# EAGLE design rapidshark-fuse-mk-1.0 (EAGLE 6.5.0)
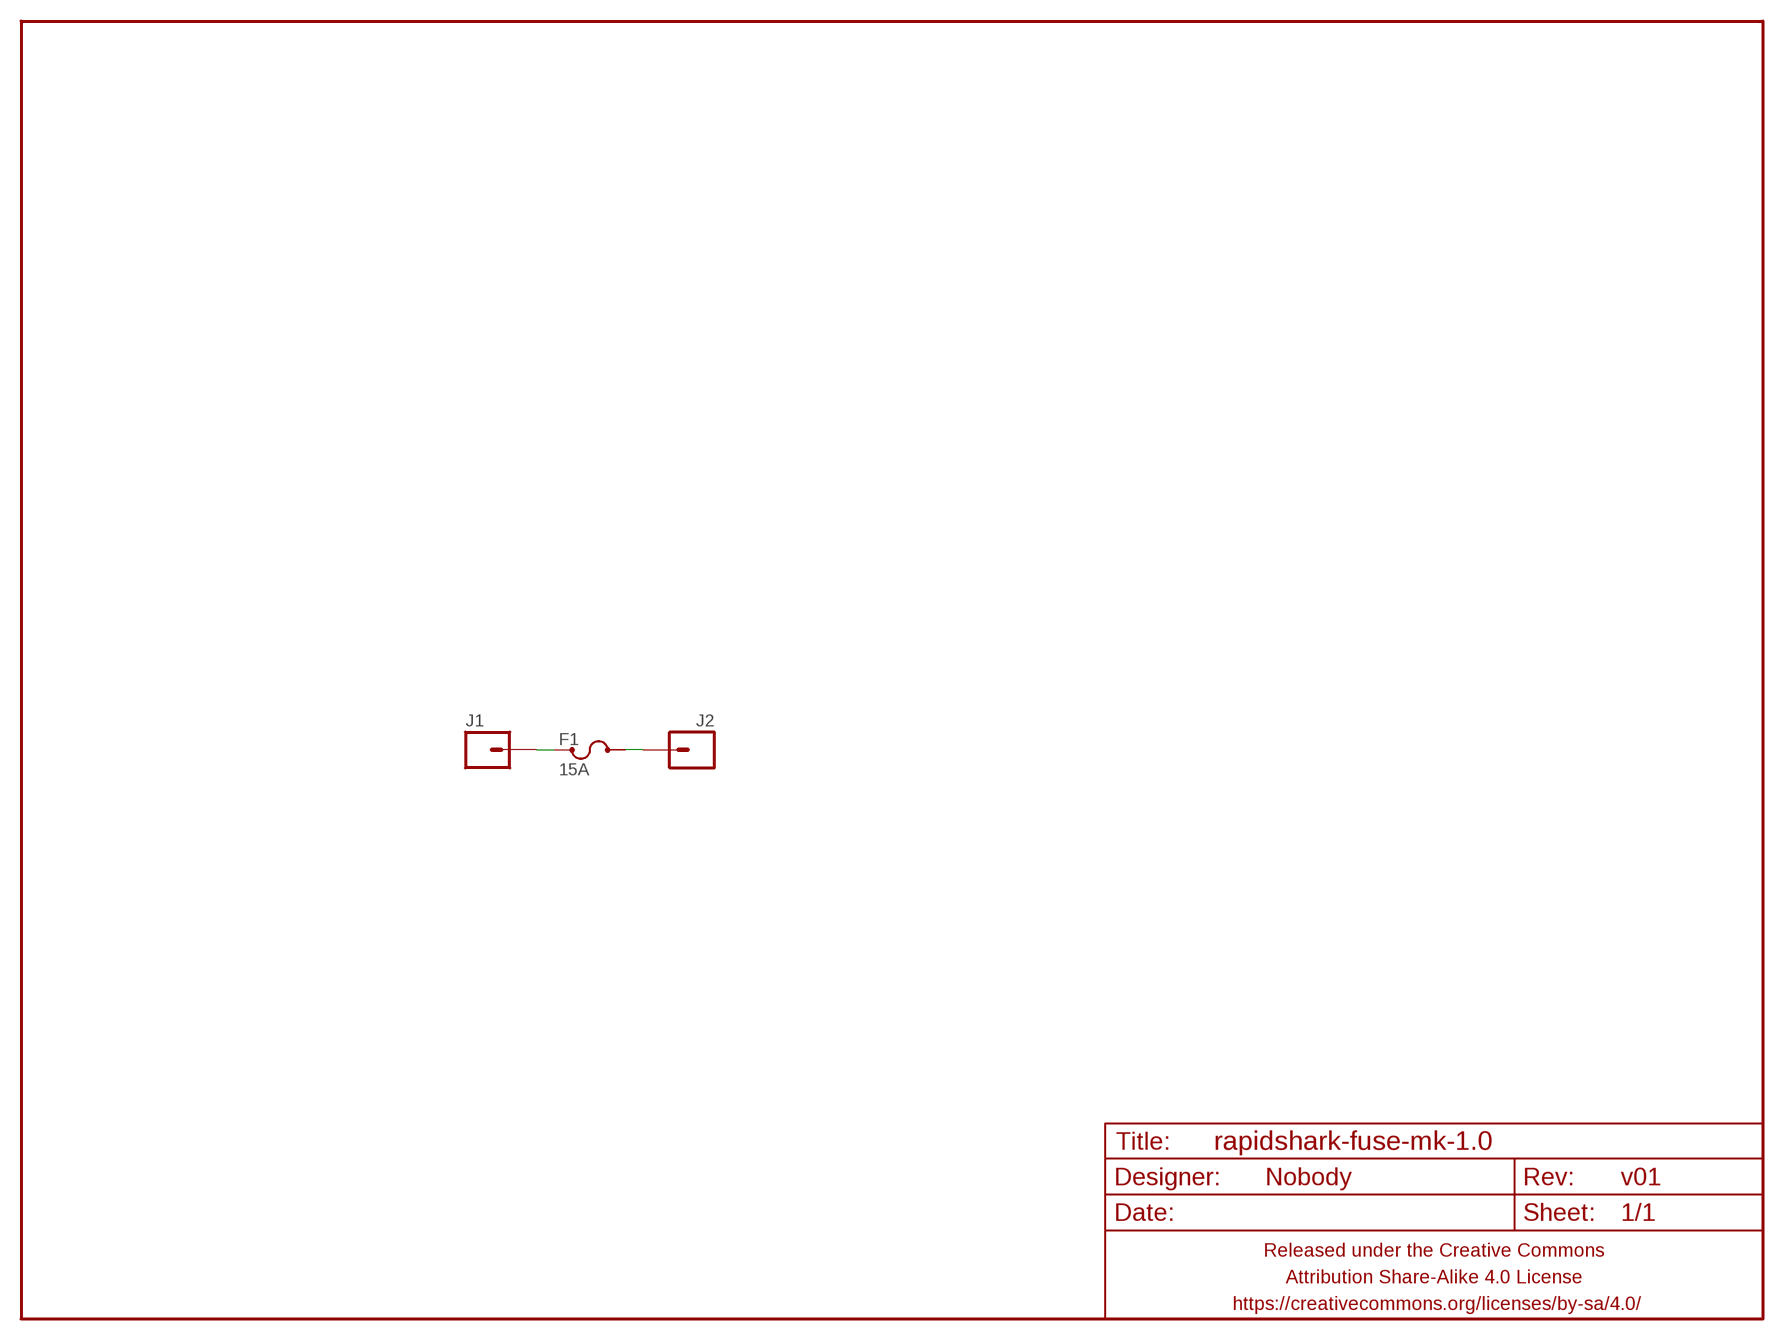
[diagram p0: schematic, sheet 1]

## Parts
F1  15A  FUSEMINI-AUTO  [KEYSTONE-MINI-AUTO-FUSE-HOLDER]
FRAME1  FRAME-LETTERNO_PACKAGE  [DUMMY]
J1  M0112AWG-OFFSET  [1X01-12AWG-OFFSET]
J2  M0112AWG-OFFSET  [1X01-12AWG-OFFSET]

## Nets
A: F1.P1@1 F1.P1@2 J1.1
B: F1.P2@1 F1.P2@2 J2.1

## Library data of the parts
F1 = A_butts:FUSE
FRAME1 = A_butts:FRAME-LETTER: Schematic Frame Standard 8.5x11 US Letter frame; DESIGNER: Nobody; VERSION: v01
J1 J2 = A_butts:M01: Header 1 Standard 1-pin 0.1" header. Use with straight break away headers (SKU : PRT-00116), right angle break away headers (PRT-00553), swiss pins (PRT-00743), machine pins (PRT-00117), and female headers (PRT-00115).

## Board
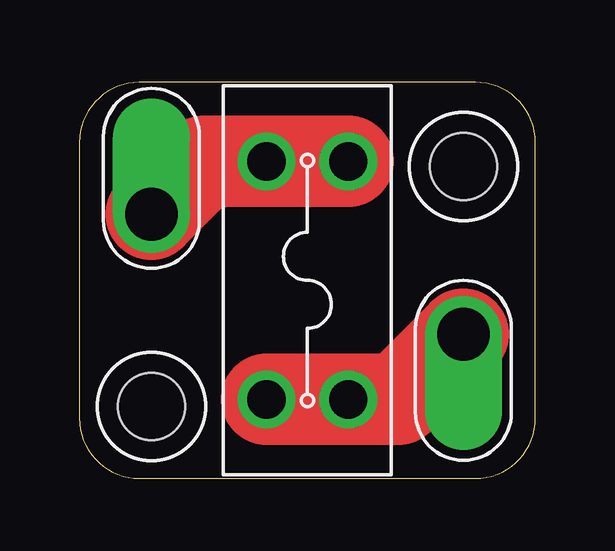
[diagram p1: board, top side]
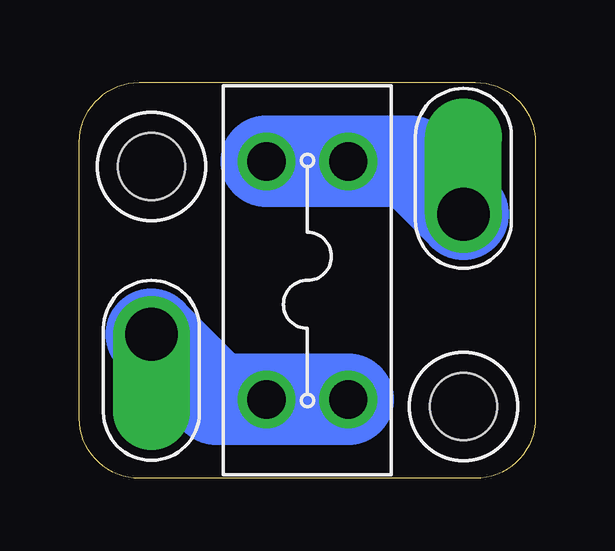
[diagram p2: board, bottom side, seen from below]

Size 19 x 16.5 mm. Coordinates in mm from the lower left corner, seen from the top.
Outline: 0,14 0,2.5 arc90 2.5,0 16.5,0 arc90 19,2.5 19,14 arc90 16.5,16.5 2.5,16.5 arc90 0,14
Copper layers (1*16): Top 0.0356mm / dielectric 1.5011mm / Bottom 0.0356mm
Design rules "LaenPCBOrder_2": minimum track width 6mil, minimum drill 13mil, track to track 6mil, track to pad 6mil, pad to pad 6mil, via to via 6mil, smd to smd 6mil, copper to edge 15mil, drill to drill 6mil, minimum pad ring 7mil, minimum via ring 7mil, stop-mask expansion 3mil, vias tented up to drill 20mil, thermal gap 10mil
Holes 2.8 mm at 3,3 16,13

### Footprints (pad centres in the part's own frame; a part is rotated, then mirrored left to right if it is on the bottom)
KEYSTONE-MINI-AUTO-FUSE-HOLDER = drill 1.6: P1@1 -4.96,1.7; P1@2 -4.96,-1.7; P2@1 4.96,1.7; P2@2 4.96,-1.7
1X01-12AWG-OFFSET = drill 2.2 pad 3 offset: 1 0,0

### Placement (x,y rotation side)
F1  9.5,8.25 270 top
FRAME1  0,0 0 top
J1  3,11 180 top
J2  16,6 0 bottom

### Tracks (layer width: path | path; a pad name or v marks a point on that pad's centre or on a via)
A
  Top 3.81: J1.1 5.21,13.21 F1.P1@2 F1.P1@1
  Bottom 3.81: J1.1 5.21,13.21 F1.P1@1
B
  Top 3.81: J2.1 13.29,3.29 F1.P2@1 F1.P2@2
  Bottom 3.81: F1.P2@2 13.29,3.29 J2.1